# EasyEDA schematic SCH_USB_hub_2024-10-12.json
TITLE: Sheet_1; REV: 1.0; Date: 2024-10-11; Sheet: 1/1; Drawn By: taranmittal09; Company: Your Company
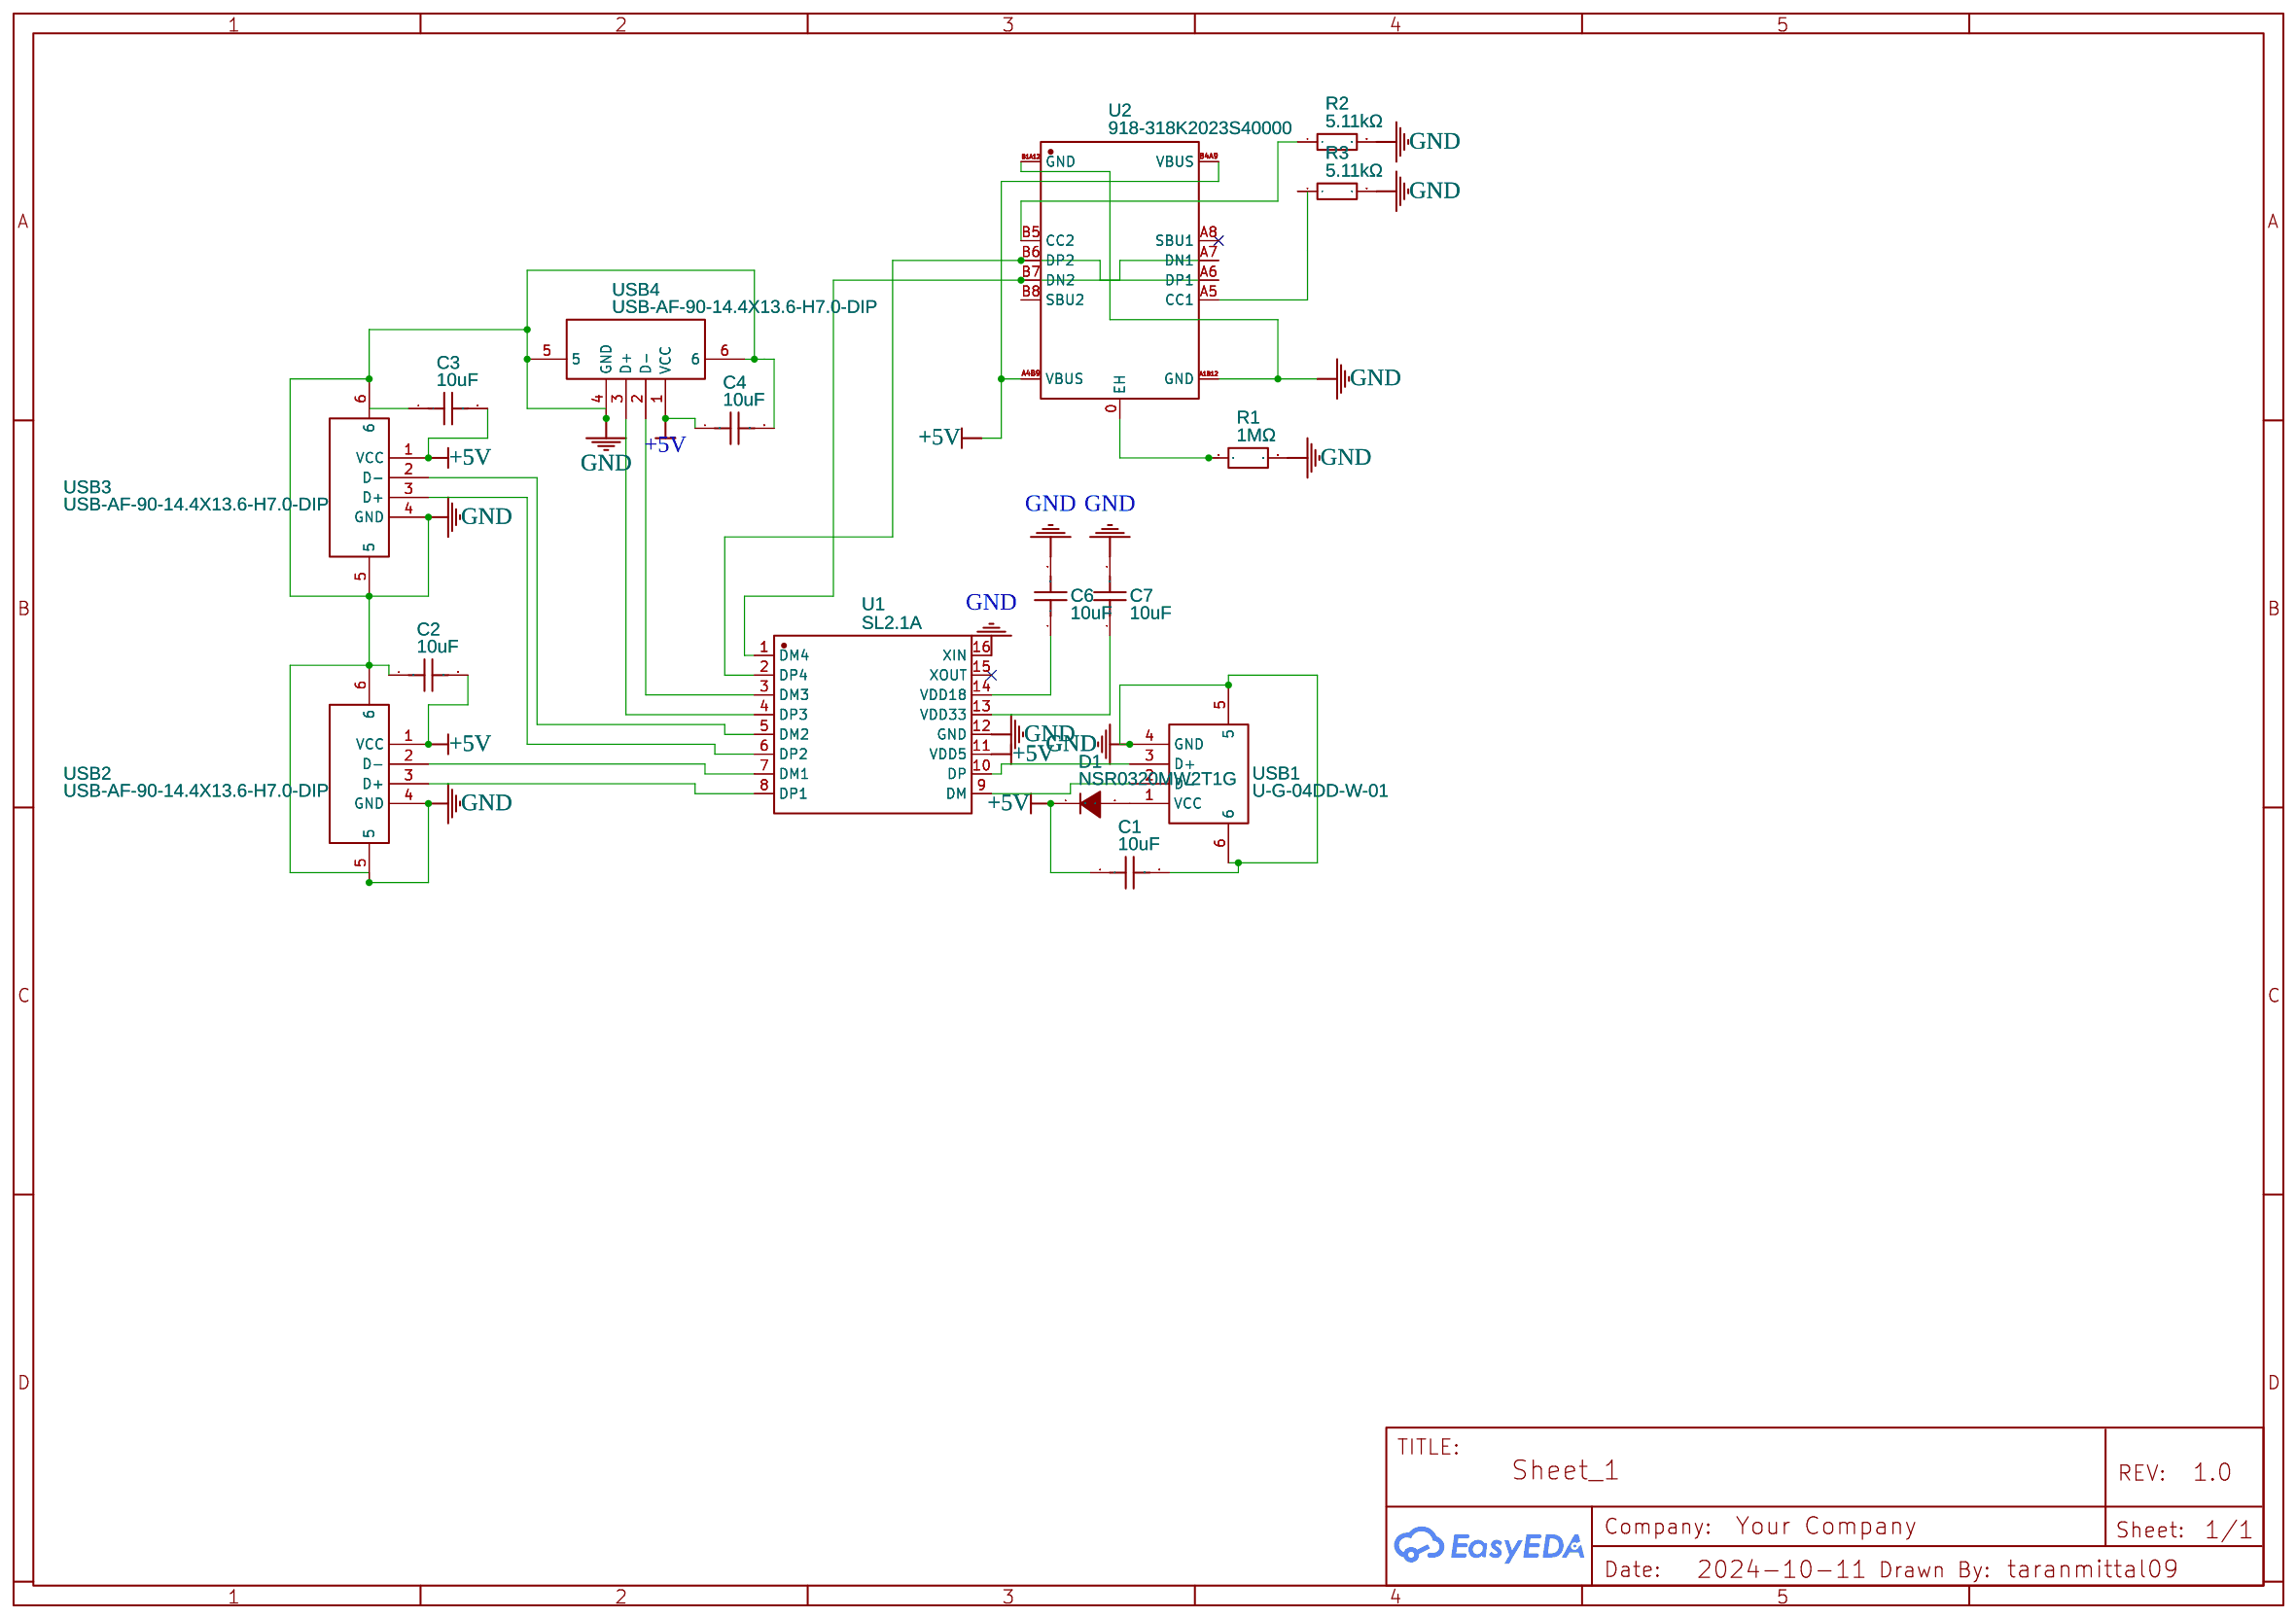
[diagram p0: schematic sheet]

## Parts
C1  10uF  [C0603]
C2  10uF  [C0603]
C3  10uF  [C0603]
C4  10uF  [C0603]
C6  10uF  [C0603]
C7  10uF  [C0603]
D1  NSR0320MW2T1G  [SOD-323_L1.8-W1.3-LS2.5-RD]
R1  1MΩ  [R0805]
R2  5.11kΩ  [R0603]
R3  5.11kΩ  [R0603]
U1  SL2.1A  [SOP-16_L10.0-W3.9-P1.27-LS6.0-BL]
U2  918-318K2023S40000  [USB-C-SMD_918-318K2023S40000]
USB1  U-G-04DD-W-01  [USB-A-TH_U-G-04WD-W-01]
USB2  USB-AF-90-14.4X13.6-H7.0-DIP  [USB-A-TH_C46407]
USB3  USB-AF-90-14.4X13.6-H7.0-DIP  [USB-A-TH_C46407]
USB4  USB-AF-90-14.4X13.6-H7.0-DIP  [USB-A-TH_C46407]

## Library data of the parts
C1-C4 C6 C7 = CL10A106KP8NNNC: Supplier: LCSC; Manufacturer: SAMSUNG(三星); Supplier Part: C19702; JLCPCB Part Class: Basic Part
D1 = NSR0320MW2T1G: Supplier: LCSC; Manufacturer: onsemi(安森美); Supplier Part: C48192; JLCPCB Part Class: Extended Part
R1 = CRCW08051M00FKTB: Supplier: LCSC; Supplier Part: C1854743; Manufacturer: VISHAY(威世); JLCPCB Part Class: Extended Part; Contributor: lcsc
R2 R3 = RS-03K5111FT: Supplier: LCSC; Manufacturer: FH(风华); Supplier Part: C140085; JLCPCB Part Class: Extended Part
U1 = SL2.1A: Contributor: LCSC; Supplier: LCSC; Supplier Part: C192893; Manufacturer: CoreChips(和芯润德); JLCPCB Part Class: Extended Part
U2 = 918-318K2023S40000: Supplier: LCSC; Supplier Part: C19189945; Manufacturer: 精拓金; JLCPCB Part Class: Extended Part; Contributor: lcsc
USB1 = U-G-04DD-W-01: Supplier: LCSC; Manufacturer: 韩国韩荣; Manufacturer Part: U-G-O4DD-W-1; Supplier Part: C98125; JLCPCB Part Class: Extended Part
USB2-USB4 = USB-AF-90-14.4X13.6-H7.0-DIP: Contributor: LCSC; Supplier: LCSC; Supplier Part: C46407; Manufacturer: 精拓金; Manufacturer Part: 903-131A1011D10100; JLCPCB Part Class: Extended Part

## Nets
+5V: C1.1 C2.2 C3.2 C4.1 D1.1(C) U1.11(VDD5) U2.A4B9(VBUS) U2.B4A9(VBUS) USB2.1(VCC) USB3.1(VCC) USB4.1(VCC)
GND: C1.2 C2.1 C3.1 C4.2 C6.2 C7.2 R1.2 R2.2 R3.2 U1.12(GND) U1.16(XIN) U2.A1B12(GND) U2.B1A12(GND) USB1.4(GND) USB1.5 USB1.6 USB2.4(GND) USB2.5 USB2.6 USB3.4(GND) USB3.5 USB3.6 USB4.4(GND) USB4.5 USB4.6
Net-(C6-1): C6.1 U1.14(VDD18)
Net-(C7-1): C7.1 U1.13(VDD33)
Net-(D1-2): D1.2(A) USB1.1(VCC)
Net-(R1-1): R1.1 U2.0(EH)
Net-(R2-1): R2.1 U2.B5(CC2)
Net-(R3-1): R3.1 U2.A5(CC1)
Net-(U1-1): U1.1(DM4) U2.A7(DN1) U2.B7(DN2)
Net-(U1-2): U1.2(DP4) U2.A6(DP1) U2.B6(DP2)
Net-(U1-3): U1.3(DM3) USB4.2(D-)
Net-(U1-4): U1.4(DP3) USB4.3(D+)
Net-(U1-5): U1.5(DM2) USB3.2(D-)
Net-(U1-6): U1.6(DP2) USB3.3(D+)
Net-(U1-7): U1.7(DM1) USB2.2(D-)
Net-(U1-8): U1.8(DP1) USB2.3(D+)
Net-(U1-9): U1.9(DM) USB1.2(D-)
Net-(U1-10): U1.10(DP) USB1.3(D+)

Not connected (* = marked no-connect by the designer): U1 15(XOUT)*; U2 A8(SBU1)* B8(SBU2)
